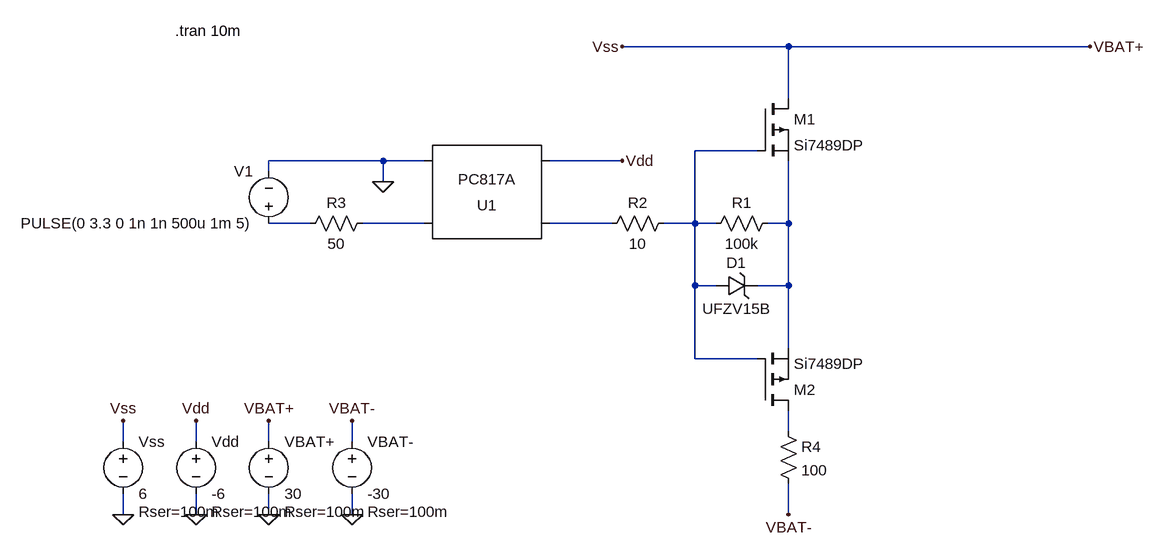
[diagram p0: schematic Draft6.asc]
Draft6.asc, the LTspice schematic file:
Version 4.1
SHEET 1 880 772
WIRE 304 -64 48 -64
WIRE 768 -64 304 -64
WIRE 304 16 304 -64
WIRE 256 96 160 96
WIRE -320 112 -496 112
WIRE -256 112 -320 112
WIRE 48 112 -64 112
WIRE -496 128 -496 112
WIRE -320 144 -320 112
WIRE -432 208 -496 208
WIRE -256 208 -352 208
WIRE 32 208 -64 208
WIRE 160 208 160 96
WIRE 160 208 112 208
WIRE 192 208 160 208
WIRE 304 208 304 112
WIRE 304 208 272 208
WIRE 160 304 160 208
WIRE 192 304 160 304
WIRE 304 304 304 208
WIRE 304 304 256 304
WIRE 304 400 304 304
WIRE 160 416 160 304
WIRE 256 416 160 416
WIRE 304 528 304 496
WIRE -720 544 -720 512
WIRE -608 544 -608 512
WIRE -496 544 -496 512
WIRE -368 544 -368 512
WIRE -720 656 -720 624
WIRE -608 656 -608 624
WIRE -496 656 -496 624
WIRE -368 656 -368 624
WIRE 304 656 304 608
FLAG -320 144 0
FLAG -720 656 0
FLAG -608 656 0
FLAG -496 656 0
FLAG -368 656 0
FLAG -720 512 Vss
FLAG -608 512 Vdd
FLAG -496 512 VBAT+
FLAG -368 512 VBAT-
FLAG 304 656 VBAT-
FLAG 768 -64 VBAT+
FLAG 48 112 Vdd
FLAG 48 -64 Vss
SYMBOL pmos 256 16 R0
SYMATTR InstName M1
SYMATTR Value Si7489DP
SYMBOL pmos 256 496 M180
SYMATTR InstName M2
SYMATTR Value Si7489DP
SYMBOL res 288 192 R90
WINDOW 0 0 56 VBottom 2
WINDOW 3 32 56 VTop 2
SYMATTR InstName R1
SYMATTR Value 100k
SYMBOL zener 192 320 R270
WINDOW 0 36 32 VTop 2
WINDOW 3 -4 32 VBottom 2
SYMATTR InstName D1
SYMATTR Value UFZV15B
SYMBOL res 128 192 R90
WINDOW 0 0 56 VBottom 2
WINDOW 3 32 56 VTop 2
SYMATTR InstName R2
SYMATTR Value 10
SYMBOL voltage -496 224 R180
WINDOW 0 24 96 Left 2
WINDOW 3 24 16 Left 2
WINDOW 123 0 0 Left 0
WINDOW 39 0 0 Left 0
SYMATTR InstName V1
SYMATTR Value PULSE(0 3.3 0 1n 1n 500u 1m 5)
SYMBOL Optos\\PC817A -160 160 M180
SYMATTR InstName U1
SYMBOL res -336 192 R90
WINDOW 0 0 56 VBottom 2
WINDOW 3 32 56 VTop 2
SYMATTR InstName R3
SYMATTR Value 50
SYMBOL res 288 512 R0
SYMATTR InstName R4
SYMATTR Value 100
SYMBOL voltage -720 528 R0
WINDOW 123 0 0 Left 0
WINDOW 39 24 124 Left 2
SYMATTR InstName Vss
SYMATTR Value 6
SYMATTR SpiceLine Rser=100m
SYMBOL voltage -608 528 R0
WINDOW 123 0 0 Left 0
WINDOW 39 24 124 Left 2
SYMATTR InstName Vdd
SYMATTR Value -6
SYMATTR SpiceLine Rser=100m
SYMBOL voltage -496 528 R0
WINDOW 123 0 0 Left 0
WINDOW 39 24 124 Left 2
SYMATTR InstName VBAT+
SYMATTR Value 30
SYMATTR SpiceLine Rser=100m
SYMBOL voltage -368 528 R0
WINDOW 123 0 0 Left 0
WINDOW 39 24 124 Left 2
SYMATTR InstName VBAT-
SYMATTR Value -30
SYMATTR SpiceLine Rser=100m
TEXT -640 -88 Left 2 !.tran 10m

The netlist it stands for:
* Draft6.asc
M1 VBAT+ N001 N005 N005 Si7489DP
M2 N006 N001 N005 N005 Si7489DP
R1 N005 N001 100k
D1 N001 N005 UFZV15B
R2 N001 N004 10
V1 N002 0 PULSE(0 3.3 0 1n 1n 500u 1m 5)
X§U1 N003 0 N004 Vdd PC817 Igain=1m
R3 N003 N002 50
R4 N006 VBAT- 100
Vss VBAT+ 0 6 Rser=100m
Vdd Vdd 0 -6 Rser=100m
VBAT+ VBAT+ 0 30 Rser=100m
VBAT- VBAT- 0 -30 Rser=100m
.model D D
.lib standard.dio
.model NMOS NMOS
.model PMOS PMOS
.lib standard.mos
.tran 10m
.lib PC817.sub
.backanno
.end

* Results of the author's LTspice run, read from the files saved beside the schematic
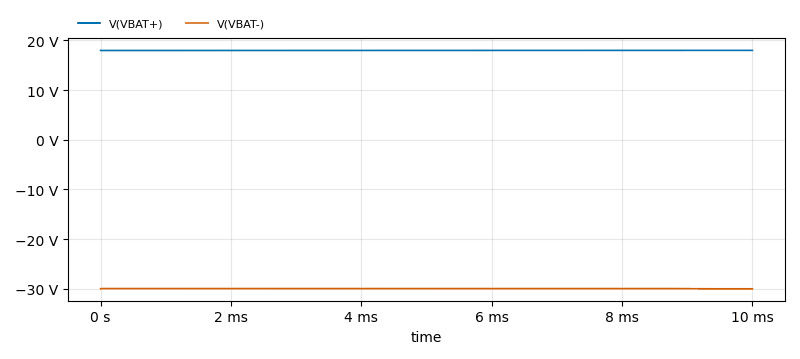
[diagram p1: Transient Analysis of Draft6.asc, plotted from the saved traces]
* Transient Analysis, 1 run:
*   V(VBAT+): min 17.97 V, max 18 V, average 17.98 V, rms 17.98 V, last 18 V
*   V(VBAT-): min -30 V, max -29.95 V, average -29.96 V, rms 29.96 V, last -30 V